# Altium schematic sheet Power.SchDoc
size A4; SheetNumber: 4; SheetTotal: 4
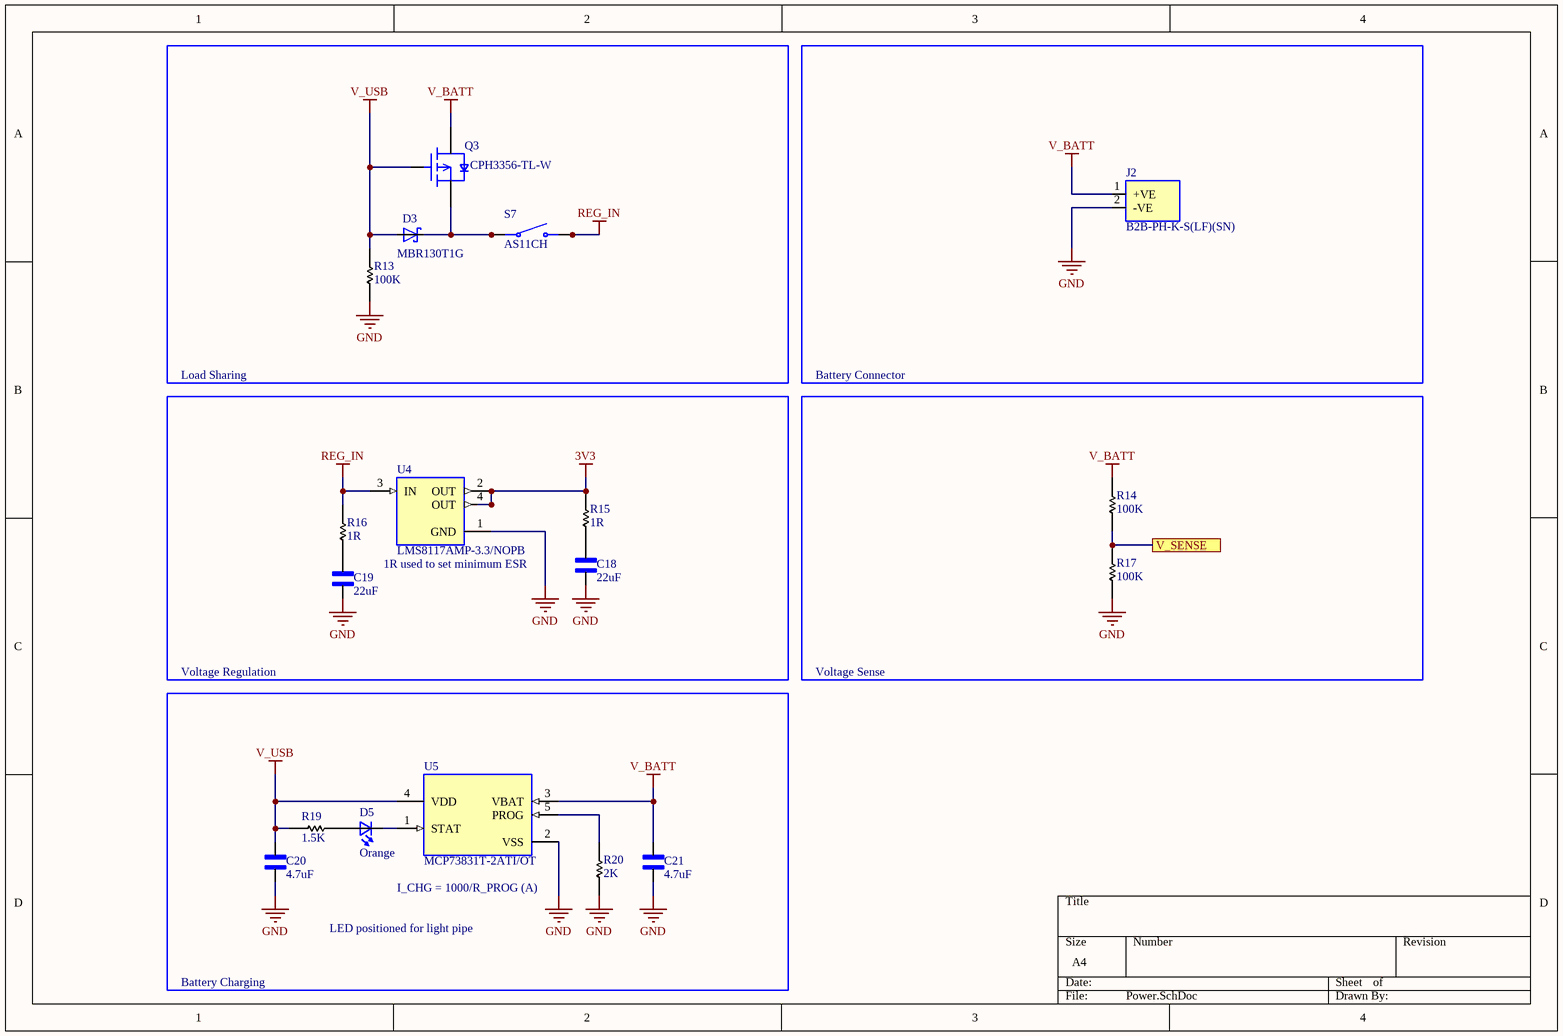
[diagram p0: Power.SchDoc]

## Parts
C18  22uF  [CHIP_0603]
C19  22uF  [CHIP_0603]
C20  4.7uF  [CHIP_0603]
C21  4.7uF  [CHIP_0603]
D3  MBR130T1G  [SOD-123-2]
D5  Orange  [0603 LED Generic]
J2  B2B-PH-K-S(LF)(SN)  [JST_B2B-PH-K-S(LF)(SN)]
Q3  CPH3356-TL-W  [SOT23-3]
R13  100K  [CHIP_R_0603]
R14  100K  [CHIP_R_0603]
R15  1R  [CHIP_R_0603]
R16  1R  [CHIP_R_0603]
R17  100K  [CHIP_R_0603]
R19  1.5K  [CHIP_R_0603]
R20  2K  [CHIP_R_0603]
S7  AS11CH  [AS11CH]
U4  LMS8117AMP-3.3/NOPB  [SOT230P700X180-4N]
U5  MCP73831T-2ATI/OT  [SOT95P280X145-5N]

## Blocks framed on the sheet
Load Sharing: D3 Q3 R13 S7
Battery Connector: J2

## Ports
V_SENSE

## Nets
3V3: R15.1 U4.2(OUT) U4.4(OUT)
GND: C18.2 C19.2 C20.2 C21.2 J2.2(-VE) R13.2 R17.2 R20.2 U4.1(GND) U5.2(VSS)
REG_IN: R16.1 S7.1 S7.3(NO) U4.3(IN)
V_BATT: C21.1 J2.1(+VE) Q3.3(D) R14.1 U5.3(VBAT)
V_USB: C20.1 D3.A Q3.1(G) R13.1 R19.1 U5.4(VDD)
V_SENSE: R14.2 R17.1 ; port V_SENSE
NetC18_1: C18.1 R15.2
NetC19_1: C19.1 R16.2
NetD3_C: D3.C Q3.2(S) S7.1(COM) S7.3
NetD5_1: D5.1(K2) U5.1(STAT)
NetD5_2: D5.2(A2) R19.2
NetR20_1: R20.1 U5.5(PROG)

## Notes on the sheet
- 1R used to set minimum ESR
- Voltage Regulation
- Voltage Sense
- I_CHG = 1000/R_PROG (A)
- Battery Charging
- LED positioned for light pipe

## Library data of the parts
C18-C21 = 0603 Ceramic Capacitor: Generic 0603 Ceramic Capacitor; MP: AC0402FR-071ML; MF: Yageo; Package: 1005 Yageo; SnapEDA_Link: https://www.snapeda.com/parts/AC0402FR-071ML/Yageo/view-part/940461/?ref=snap; Value: *; Mouser-Purchase-URL: https://snapeda.com/shop?store=Mouser&id=940461; DigiKey-Purchase-URL: https://snapeda.com/shop?store=DigiKey&id=940461
D3 = MBR130T1G: Diode Schottky 30 V 1A Surface Mount SOD-123; MP: MBR0530; MF: ON Semiconductor; Arrow_Electronics-Purchase-URL: https://snapeda.com/shop?store=Arrow+Electronics&id=2580921; Price: None; Package: SOD-123 Diodes Inc.; Value: *; DigiKey-Purchase-URL: https://snapeda.com/shop?store=DigiKey&id=2580921; Availability: Good; Mouser-Purchase-URL: https://snapeda.com/shop?store=Mouser&id=2580921; SnapEDA_Link: https://www.snapeda.com/parts/MBR0530/ON%20Semiconductor/view-part/2580921/?ref=snap
D5 = 0603 Generic LED: Value: *
J2 = B2B-PH-K-S(LF)(SN): Connector Header Through Hole 2 position 0.079" (2.00mm); MP: S2B-PH-SM4-TB_LF__SN_; MF: JST Sales; SnapEDA_Link: https://www.snapeda.com/parts/S2B-PH-SM4-TB%28LF%29%28SN%29/JST%20Sales%20America%20Inc./view-part/46879/?ref=snap; Package: None; Digi-Key_Part_Number: 455-1749-1-ND; Digi-Key_Purchase_URL: https://www.digikey.com.au/product-detail/en/jst-sales-america-inc/S2B-PH-SM4-TB_LF__SN_/455-1749-1-ND/926846?utm_source=snapeda&utm_medium=aggregator&utm_campaign=symbol; Value: *
Q3 = CPH3356-TL-W: P-Channel 20 V 2.5A (Ta) 1W (Ta) Surface Mount 3-CPH
R13-R17 R19 R20 = 0603 Generic Resistor: Generic 0603 Resistor
S7 = AS11CH: SWITCH SLIDE SPST 0.4VA 28V
U4 = LMS8117AMP-3.3/NOPB: Fixed 3.3V LDO 1A 15V input SOT-223; MF: Texas Instruments; SnapEDA_Link: https://www.snapeda.com/parts/LMS8117AMP-3.3/NOPB/Texas%20Instruments/view-part/104396/?ref=snap; Price: None; Check_prices: https://www.snapeda.com/parts/LMS8117AMP-3.3/NOPB/Texas%20Instruments/view-part/104396/?ref=eda; Purchase-URL: https://pricing.snapeda.com/search/part/LMS8117AMP-3.3/NOPB/?ref=eda; Value: *; MP: LMS8117AMP-3.3/NOPB; Package: SOT-223-4 Texas Instruments; Availability: Warning
U5 = MCP73831T-2ATI/OT: Charger IC Lithium Ion/Polymer SOT-23-5; MF: Microchip; Availability: Unavailable; SnapEDA_Link: https://www.snapeda.com/parts/MCP73831T-2ATI/OT/Microchip/view-part/51423/?ref=snap; Price: None; MP: MCP73831T-2ATI/OT; Arrow_Americas-Purchase-URL: https://snapeda.com/shop?store=Arrow+Americas&id=51423; Package: SOT-23 Microchip; DigiKey-Purchase-URL: https://snapeda.com/shop?store=DigiKey&id=51423; Value: *; Mouser-Purchase-URL: https://snapeda.com/shop?store=Mouser&id=51423